# Altium schematic sheet Block Diagram.SchDoc
size A3; Date: 15.03.2023; ApprovedBy: Mustafa Berk AYDOĞAN; CheckedBy: Udemy Instructor; SheetNumber: 1; SheetTotal: 4; Descripton: Wireless Security Detector; Prepared by: Mustafa Emin ADAK; Department: R&D Hardware
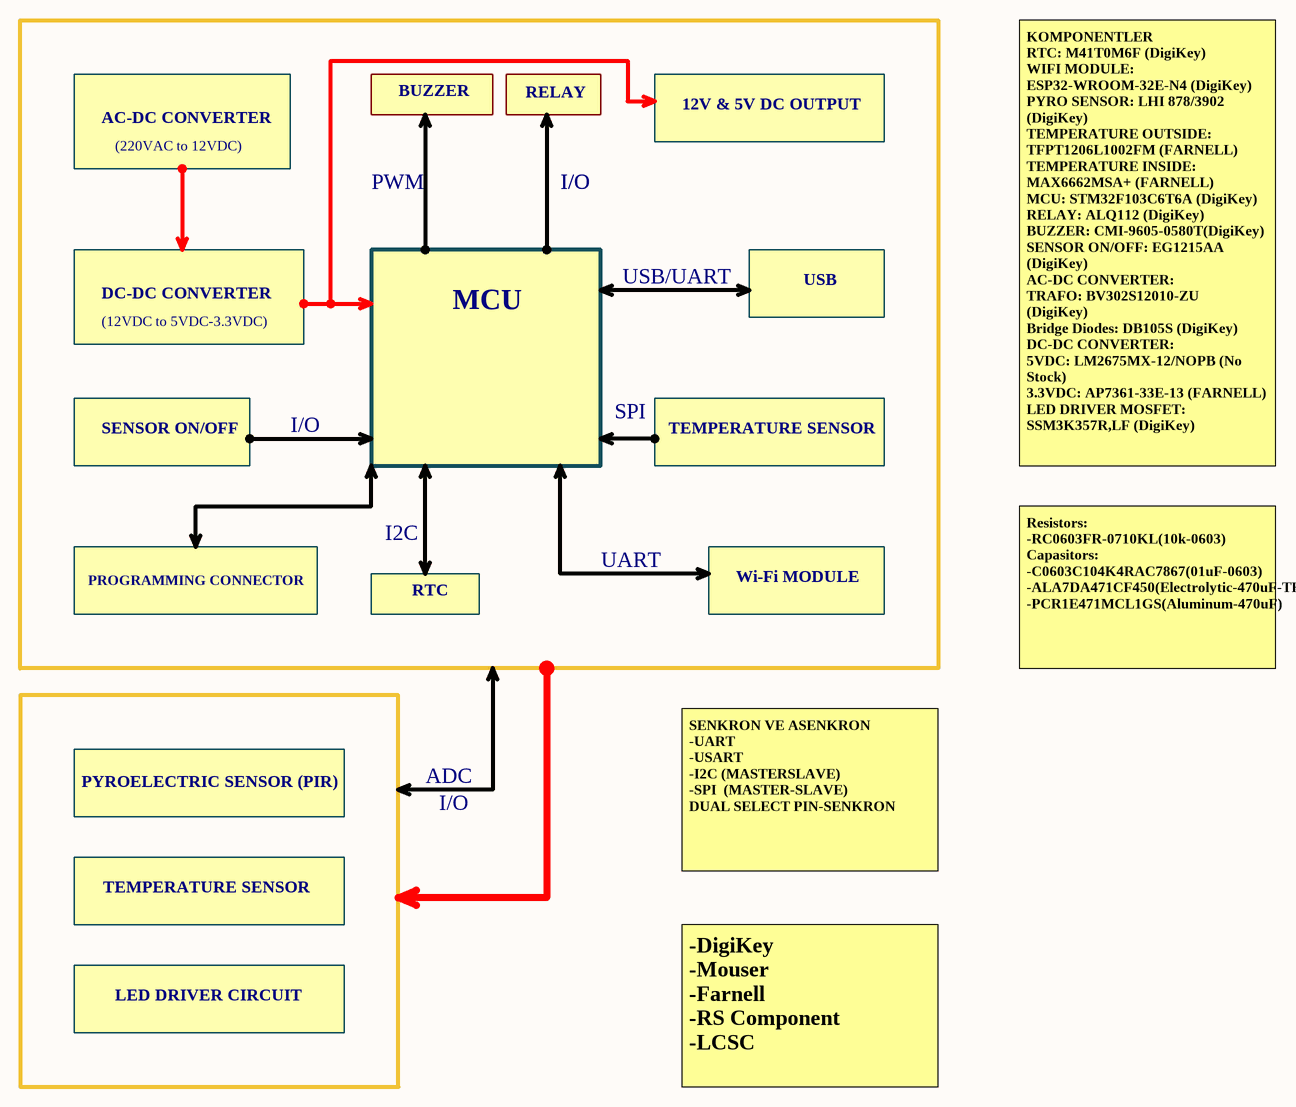
[diagram p0: Block Diagram.SchDoc]

## Notes on the sheet
- BUZZER
- RELAY
- AC-DC CONVERTER
- (220VAC to 12VDC)
- 12V & 5V DC OUTPUT
- PWM
- I/O
- DC-DC CONVERTER
- USB/UART
- USB
- (12VDC to 5VDC-3.3VDC)
- MCU
- SENSOR ON/OFF
- SPI
- TEMPERATURE SENSOR
- KOMPONENTLER                          RTC: M41T0M6F (DigiKey)                                                WIFI MODULE: ESP32-WROOM-32E-N4 (DigiKey)                             PYRO SENSOR: LHI 878/3902  (DigiKey)                           TEMPERATURE OUTSIDE: TFPT1206L1002FM (FARNELL)          TEMPERATURE INSIDE: MAX6662MSA+ (FARNELL)                   MCU: STM32F103C6T6A (DigiKey)                                                RELAY: ALQ112 (DigiKey)                                               BUZZER: CMI-9605-0580T(DigiKey)                                     SENSOR ON/OFF: EG1215AA (DigiKey)                                           AC-DC CONVERTER:                  TRAFO: BV302S12010-ZU            (DigiKey)                                           Bridge Diodes: DB105S (DigiKey)                                                                      DC-DC CONVERTER:                   5VDC: LM2675MX-12/NOPB (No Stock)                                                     3.3VDC: AP7361-33E-13 (FARNELL)                                                     LED DRIVER MOSFET: SSM3K357R,LF (DigiKey)
- I2C
- UART
- PROGRAMMING CONNECTOR
- RTC
- Wi-Fi MODULE
- Resistors: -RC0603FR-0710KL(10k-0603)                                       Capasitors: -C0603C104K4RAC7867(01uF-0603)                                   -ALA7DA471CF450(Electrolytic-470uF-TH)                -PCR1E471MCL1GS(Aluminum-470uF)
- PYROELECTRIC SENSOR (PIR)
- ADC
- SENKRON VE ASENKRON       -UART                                             -USART                                              -I2C (MASTERSLAVE)                     -SPI  (MASTER-SLAVE)                  DUAL SELECT PIN-SENKRON
- LED DRIVER CIRCUIT
- -DigiKey                                         -Mouser                                           -Farnell                                 -RS Component                               -LCSC
- TANIM/DESCRIPTION
- DOSYA ADI/FILE NAME
- HAZIRLAYAN/PREPARED BY
- YAYIN TARİHİ/REL. DATE
- KONTROL EDEN/CHECKED BY
- ONAYLAYAN/APPROVED BY
- DEĞ. TARİHİ/ CHANGE DATE
- REVİZYON/REVISION
- BÖLÜM/DEPARTMENT
- BOYUT/SIZE
- SAYFA/SHEET